# Altium schematic sheet 01_MAIN.SchDoc: =GlobalProjectName
size 594 x 420 mm; CheckedBy: A_D; Author: A_D; SheetNumber: 1; SheetTotal: 3; PageSetup: Record=PageOptions|CenterHorizontal=True|CenterVertical=True|PrintScale=0.70|XCorrection=1.00|YCorrection=1.00|PrintKind=2|BorderSize=5000000|LeftOffset=9000|BottomOffset=10100|Orientation=2|PaperLength=11176|PaperWidth=8636|Scale=100|PaperSource=259|PrintQuality=-3|MediaType=1|DitherType=10|PrintScaleMode=1|PaperKind=A3|PaperIndex=8
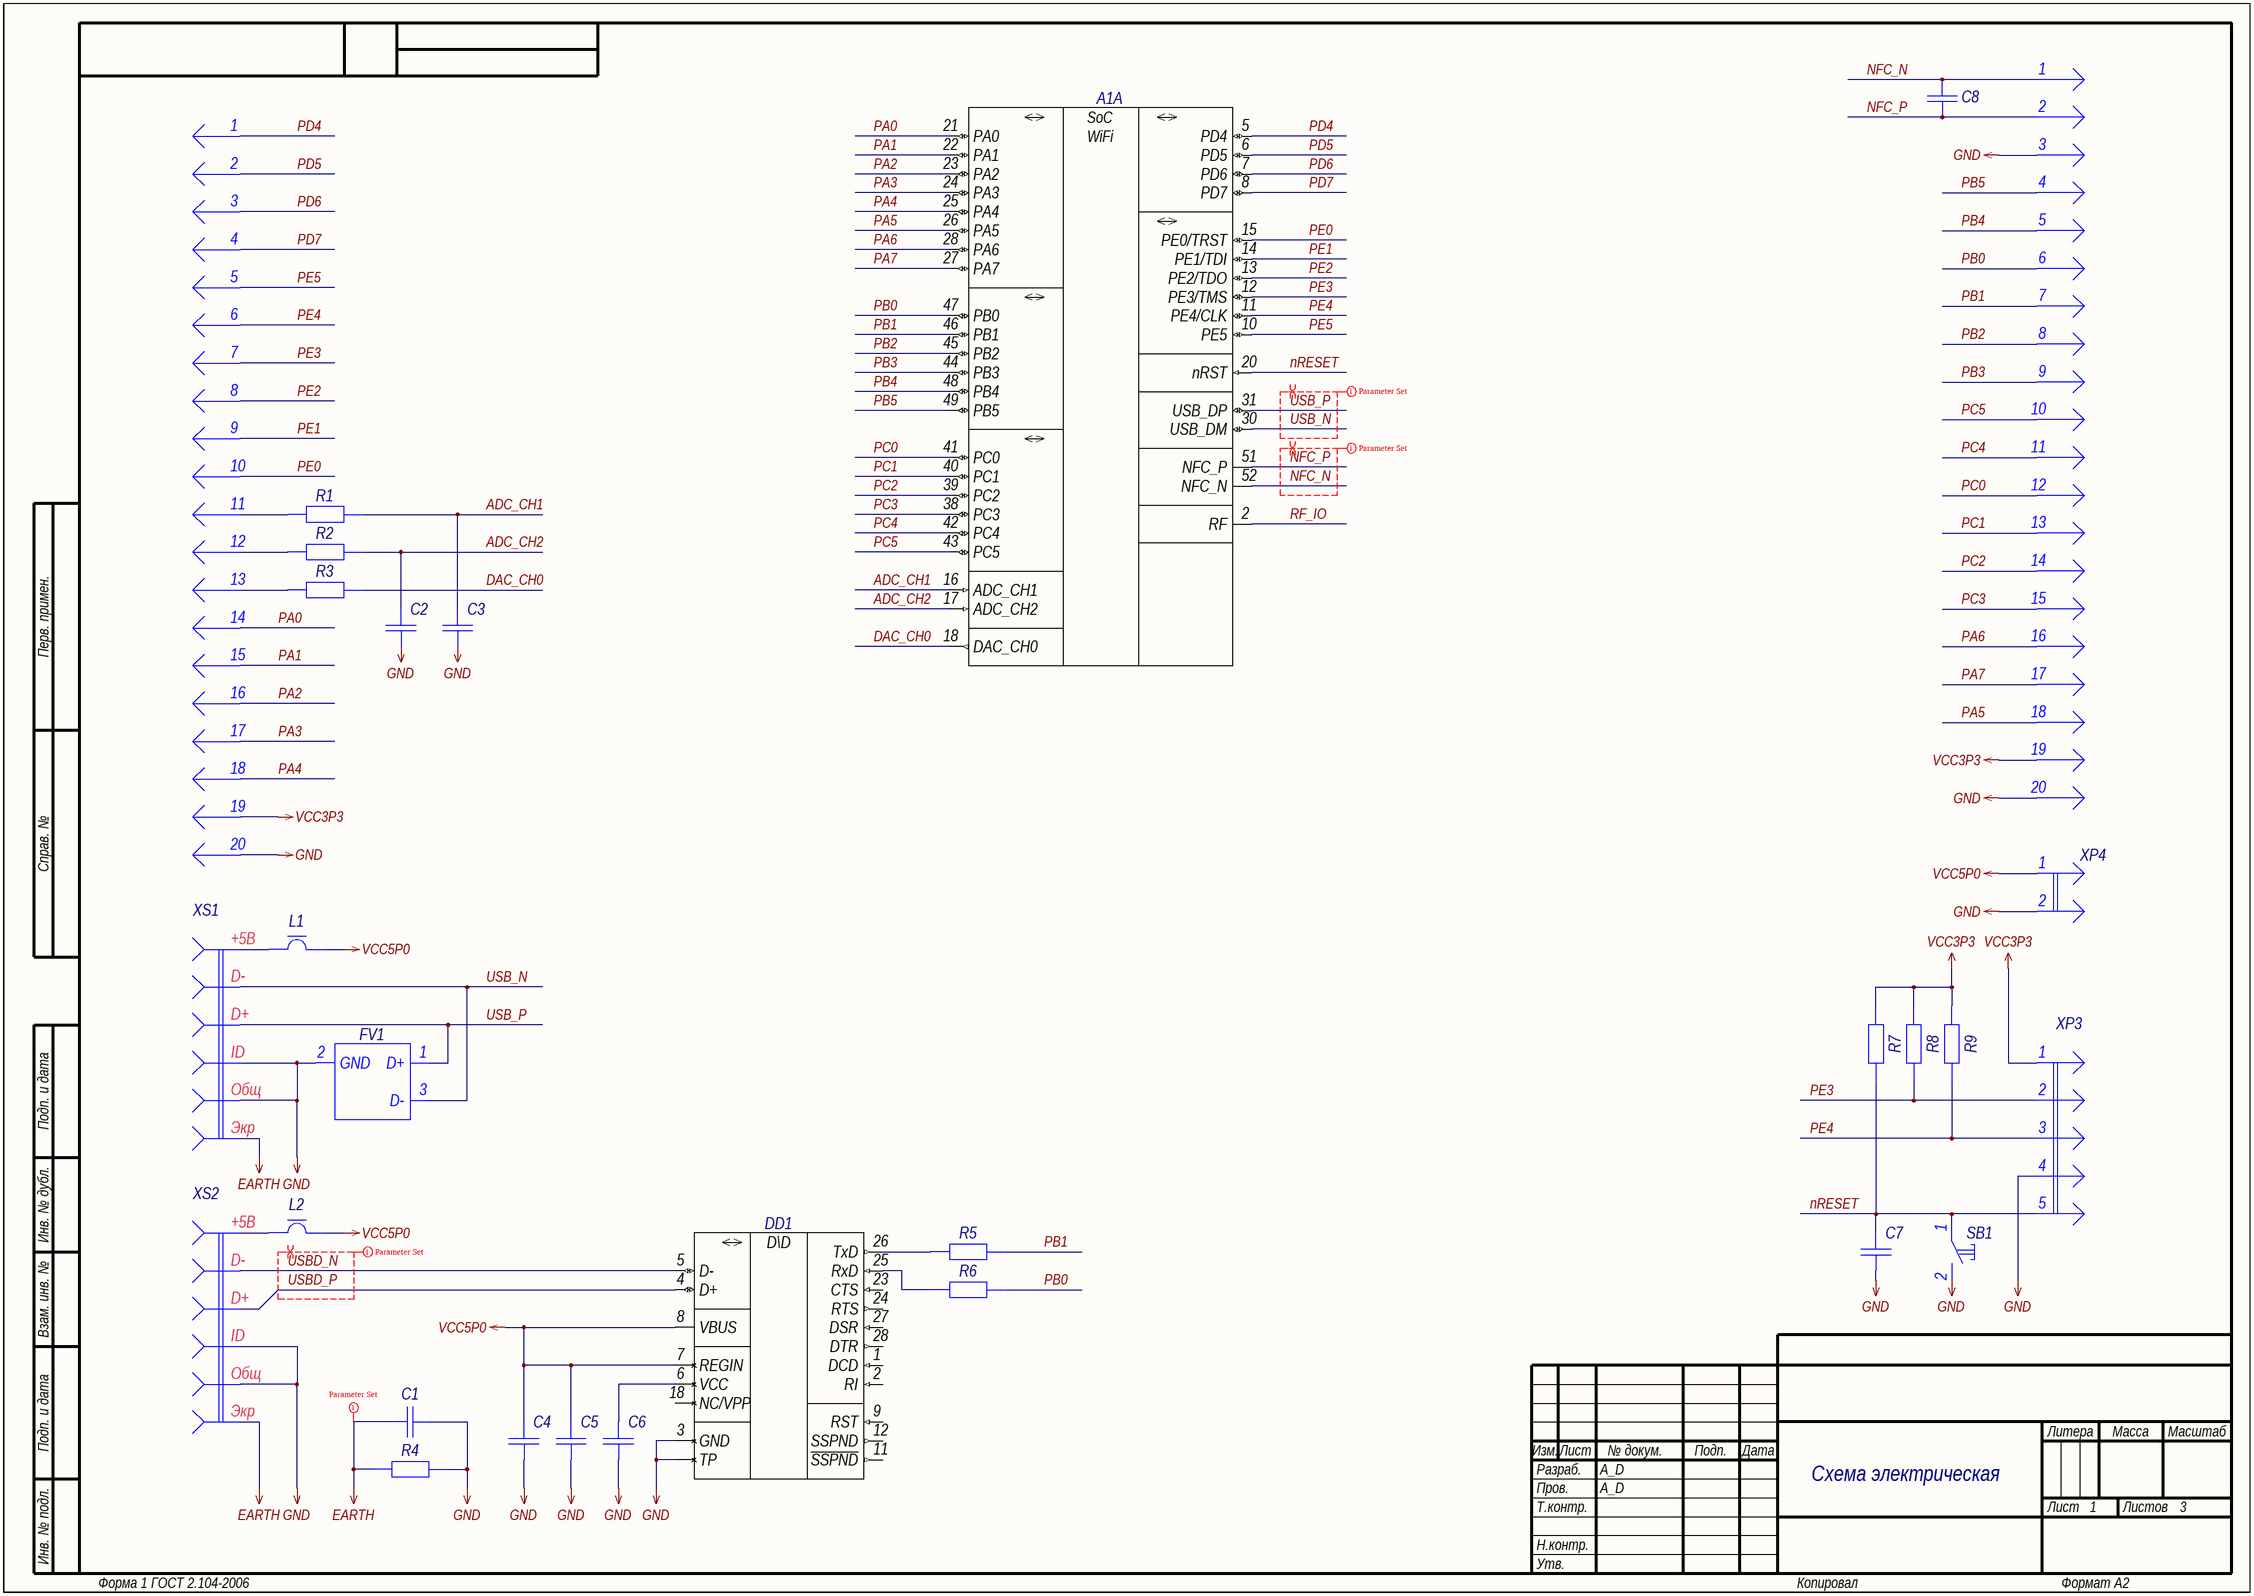
[diagram p0: 01_MAIN.SchDoc]

## Parts
A1  AMB-02  [AMB-02]  (value not drawn)  (part A of 2)
C1  Capacitor  [C0603_L]  (value not drawn)
C2  Capacitor  [C0603_L]  (value not drawn)
C3  Capacitor  [C0603_L]  (value not drawn)
C4  Capacitor  [C0603_L]  (value not drawn)
C5  Capacitor  [C0603_L]  (value not drawn)
C6  Capacitor  [C0603_L]  (value not drawn)
C7  Capacitor  [C0603_L]  (value not drawn)
C8  Capacitor  [C0603_L]  (value not drawn)
DD1  CP2102_9  [QFN-28_050P500X500X100_N]  (value not drawn)
FV1  TPD2EUSB30DRT  [SOT-3_070P100X080X050_N]  (value not drawn)
L1  FerriteBead  [L0805_L]  (value not drawn)
L2  FerriteBead  [L0805_L]  (value not drawn)
R1  Resistor  [R0603_L]  (value not drawn)
R2  Resistor  [R0603_L]  (value not drawn)
R3  Resistor  [R0603_L]  (value not drawn)
R4  Resistor  [R0603_L]  (value not drawn)
R5  Resistor  [R0603_L]  (value not drawn)
R6  Resistor  [R0603_L]  (value not drawn)
R7  Resistor  [R0603_L]  (value not drawn)
R8  Resistor  [R0603_L]  (value not drawn)
R9  Resistor  [R0603_L]  (value not drawn)
SB1  RESET  [IT-1185AP]  (value not drawn)
XP1  Text  [PLS-20]  (value not drawn)  (parts A,B,C,D,E,F,G,H,I,J,K,L,M,N,O,P,Q,R,S,T of 20)
XP2  Text  [PLS-20]  (value not drawn)  (parts A,B,C,D,E,F,G,H,I,J,K,L,M,N,O,P,Q,R,S,T of 20)
XP3  Text  [PLS-5]  (value not drawn)
XP4  Text  [PLS-2]  (value not drawn)
XS1  Text  [1981568-1]  (value not drawn)
XS2  Text  [1981568-1]  (value not drawn)

## Nets
EARTH: C1.2 R4.1 XS1.6 XS2.6
GND: C1.1 C2.1 C3.1 C4.1 C5.1 C6.1 C7.1 DD1.3(GND) DD1.TP FV1.2(GND) R4.2 SB1.2 XP1.20 XP2.3 XP2.20 XP3.4 XP4.2 XS1.4 XS1.5 XS2.4 XS2.5
VCC3P3: R7.2 R8.2 R9.2 XP1.19 XP2.19 XP3.1
VCC5P0: C4.2 C5.2 DD1.7(REGIN) DD1.8(VBUS) L1.2 L2.2 XP4.1
ADC_CH1: A1.16(ADC_CH1) C3.2 R1.2
ADC_CH2: A1.17(ADC_CH2) C2.2 R2.2
DAC_CH0: A1.18(DAC_CH0) R3.2
NFC_N: A1.52(NFC_N) C8.2 XP2.1
NFC_P: A1.51(NFC_P) C8.1 XP2.2
nRESET: A1.20(nRST) C7.2 R7.1 SB1.1 XP3.5
PA0: A1.21(PA0) XP1.14
PA1: A1.22(PA1) XP1.15
PA2: A1.23(PA2) XP1.16
PA3: A1.24(PA3) XP1.17
PA4: A1.25(PA4) XP1.18
PA5: A1.26(PA5) XP2.18
PA6: A1.28(PA6) XP2.16
PA7: A1.27(PA7) XP2.17
PB0: A1.47(PB0) R6.2 XP2.6
PB1: A1.46(PB1) R5.2 XP2.7
PB2: A1.45(PB2) XP2.8
PB3: A1.44(PB3) XP2.9
PB4: A1.48(PB4) XP2.5
PB5: A1.49(PB5) XP2.4
PC0: A1.41(PC0) XP2.12
PC1: A1.40(PC1) XP2.13
PC2: A1.39(PC2) XP2.14
PC3: A1.38(PC3) XP2.15
PC4: A1.42(PC4) XP2.11
PC5: A1.43(PC5) XP2.10
PD4: A1.5(PD4) XP1.1
PD5: A1.6(PD5) XP1.2
PD6: A1.7(PD6) XP1.3
PD7: A1.8(PD7) XP1.4
PE0: A1.15(PE0/TRST) XP1.10
PE1: A1.14(PE1/TDI) XP1.9
PE2: A1.13(PE2/TDO) XP1.8
PE3: A1.12(PE3/TMS) R8.1 XP1.7 XP3.2
PE4: A1.11(PE4/CLK) R9.1 XP1.6 XP3.3
PE5: A1.10(PE5) XP1.5
RF_IO: A1.2(RF)
USB_N: A1.30(USB_DM) FV1.3(D-) XS1.2
USB_P: A1.31(USB_DP) FV1.1(D+) XS1.3
USBD_N: DD1.5(D-) XS2.2
USBD_P: DD1.4(D+) XS2.3
NetC6_2: C6.2 DD1.6(VCC)
NetDD1_25: DD1.25(RxD) R6.1
NetDD1_26: DD1.26(TxD) R5.1
NetL1_1: L1.1 XS1.1
NetL2_1: L2.1 XS2.1
NetR1_1: R1.1 XP1.11
NetR2_1: R2.1 XP1.12
NetR3_1: R3.1 XP1.13

Not connected (* = marked no-connect by the designer): DD1 1(DCD) 2(RI) 9(RST) 11(~{SSPND}) 12(SSPND) 18(NC/VPP) 23(CTS) 24(RTS) 27(DSR) 28(DTR)

## Layout directives
differential pair: NFC_N, NFC_P, USB_N, USB_P, USBD_N, USBD_P
net class USBD; rule Matched Net Lengths [Tolerance = 1mm]: USBD_N, USBD_P
net class USB; rule Matched Net Lengths [Tolerance = 1mm]: USB_N, USB_P
net class NFC; rule Matched Net Lengths [Tolerance = 1mm]: NFC_N, NFC_P
rule Polygon Connect Style [Style - Direct Connect]: EARTH

## Notes on the sheet
- Схема электрическая
  принципиальная
- Перв. примен.
- Справ. №
- Подп. и дата
- Инв. № дубл.
- Взам. инв. №
- Разраб.
- Изм.
- Лист
- № докум.
- Подп.
- Дата
- Литера
- Масса
- Масштаб
- Пров.
- Т.контр.
- Листов
- Инв. № подл.
- Н.контр.
- Утв.
- Форма 1 ГОСТ 2.104-2006
- Копировал
- Формат А2
- (in symbol 1981568-1) +5В; D-; D+; ID; Общ; Экр
- (in symbol CP2102-GM) D\D
- (in symbol MJIOT-AMB-02, part A) SoC; WiFi

## Library data of the parts
A1 = MJIOT-AMB-02: Manufacturer: MJIOT; ID: 3; Supply Operation: +3.0…3.6V; Supply Current: 450mA; ROM/RAM: 1MB/2MB+512KB; Wireless Compatibility: 802.11 b/g/n; Supported Interfaces: JTAG, SWD, SPI, I2C, I2S, UART, PWM, PCM, SDIO, NFC, ADC, DAC, USB HS, MII/RMII; I/O Lines: 30; Operation Frequency: 166MHz; Application Category: 1; Working Temperature Min: -20°С; Working Temperature Max: +85°С; Published: 12.12.2017; Publisher: Andrew Danich; Type: Модуль; Part Number: MJIOT-AMB-02; Value: MJIOT-AMB-02
C1 C5-C7 = GRM188R72A104KA35D: Manufacturer: Murata; Type: Конденсатор; ID: 232; Value: 0.1uF; Voltage: 100V; Tolerance: ±10%; Dielectric Type: X7R; Application Category: 1; Working Temperature Min: -55°С; Working Temperature Max: +125°С; Published: 18.05.2010; Publisher: Andrew Danich; Part Number: GRM188R72A104KA35D; Footprint: 0603
  C1: ClassName: DirectConnect
C2 C3 = GCM1885C2A101JA16D: Manufacturer: Murata; Type: Конденсатор; ID: 155; Value: 100pF; Voltage: 100V; Tolerance: ±5%; Dielectric Type: NP0; Application Category: 1; Working Temperature Min: -55°С; Working Temperature Max: +125°С; Published: 18.05.2010; Publisher: Andrew Danich; Part Number: GCM1885C2A101JA16D; Footprint: 0603
C4 = GCM188R71E105KA64D: Manufacturer: Murata; Type: Конденсатор; ID: 134; Value: 1uF; Voltage: 25V; Tolerance: ±10%; Dielectric Type: X7R; Application Category: 1; Working Temperature Min: -55°С; Working Temperature Max: +85°С; Published: 18.05.2010; Publisher: Andrew Danich; Part Number: GCM188R71E105KA64D; Footprint: 0603
C8 = GRM1885C2A8R2DA01D: Manufacturer: Murata; Type: Конденсатор; ID: 215; Value: 8.2pF; Voltage: 100V; Tolerance: ±0.5pF; Dielectric Type: NP0; Application Category: 1; Working Temperature Min: -55°С; Working Temperature Max: +125°С; Published: 18.05.2010; Publisher: Andrew Danich; Part Number: GRM1885C2A8R2DA01D; Footprint: 0603
DD1 = CP2102-GM: Single Chip USB to UART Bridge; Manufacturer: Silicon Labs; ID: 4; Supply Operation: +3.3V; Supply Current: 13.7mA; USB Type Support: USB 2.0; USB Speed Support: 12 Mb/s; OTG Support: No; Channels: 1; Working Temperature Min: -40°C; Working Temperature Max: +85°C; Published: 03.08.2015; Publisher: Andrew Danich; Type: Микросхема; Part Number: CP2102-GM; Value: CP2102-GM; Input Interface: UART; Application Category: 1; Functional Analog: -
FV1 = TPD2EUSB30DRT: Manufacturer: Texas Instruments; ID: 5; Breakdown Voltage: 7V; Reverse Stand Off Voltage: 5.5V; Forward Voltage: 0.95V; Peak Forward Current: 5A; Junction Capacitance: 0.8pF; Pulse Power Dissipation: 45W; Directional: Bidirectional; Application Category: 1; Working Temperature Min: -40°С; Working Temperature Max: +85°С; Published: 27.12.2015; Publisher: Andrew Danich; Type: Супрессор; Part Number: TPD2EUSB30DRT; Value: TPD2EUSB30DRT; Functional Analog: -
L1 L2 = BLM21PG331SN1: Manufacturer: Murata; Type: Дроссель; ID: 2; Rated Current: 1.5A; Impedance at 100Mhz: 330ohm; DC Resistance: 0.07ohm; Inductor Type: EMIFIL; Application Category: 1; Working Temperature Min: -55°С; Working Temperature Max: +125°С; Published: 14.11.2014; Publisher: Andrew Danich; Part Number: BLM21PG331SN1; Value: BLM21PG331SN1; Footprint: 0805; ClassName: DirectConnect
R1 R2 = RC0603JR-07100R: Manufacturer: Yageo; ID: 10; Value: 100; Limit Voltage: 50V; Tolerance: ±5%; Temperature Coefficient: 100ppm; Total Power Dissipation: 0.1W; Series Type: Thick-Film; Application Category: 1; Working Temperature Min: -55°С; Working Temperature Max: +155°С; Functional Analog: CR0603-JW-101E; Published: 24.03.2010; Publisher: Andrew Danich; Type: Резистор; Part Number: RC0603JR-07100R; Footprint: 0603
R3 = RC0603JR-070R: Manufacturer: Yageo; ID: 5; Value: 0; Limit Voltage: 50V; Tolerance: ±5%; Temperature Coefficient: 100ppm; Total Power Dissipation: 0.1W; Series Type: Thick-Film; Application Category: 1; Working Temperature Min: -55°С; Working Temperature Max: +155°С; Functional Analog: RC0603FR-070RL, CR0603-J/-000E; Published: 24.03.2010; Publisher: Andrew Danich; Type: Резистор; Part Number: RC0603JR-070R; Footprint: 0603
R4 = RC0603JR-07100KL: Manufacturer: Yageo; ID: 11; Value: 100k; Limit Voltage: 50V; Tolerance: ±5%; Temperature Coefficient: 100ppm; Total Power Dissipation: 0.1W; Series Type: Thick-Film; Application Category: 1; Working Temperature Min: -55°С; Working Temperature Max: +155°С; Functional Analog: CR0603-JW-104E; Published: 24.03.2010; Publisher: Andrew Danich; Type: Резистор; Part Number: RC0603JR-07100KL; Footprint: 0603; ClassName: DirectConnect
R5 R6 = RC0603JR-071KL: Manufacturer: Yageo; ID: 19; Value: 1k; Limit Voltage: 50V; Tolerance: ±5%; Temperature Coefficient: 100ppm; Total Power Dissipation: 0.1W; Series Type: Thick-Film; Application Category: 1; Working Temperature Min: -55°С; Working Temperature Max: +155°С; Functional Analog: CR0603-JW-102E; Published: 24.03.2010; Publisher: Andrew Danich; Type: Резистор; Part Number: RC0603JR-071KL; Footprint: 0603
R7-R9 = RC0603JR-0710KL: Manufacturer: Yageo; ID: 12; Value: 10k; Limit Voltage: 50V; Tolerance: ±5%; Temperature Coefficient: 100ppm; Total Power Dissipation: 0.1W; Series Type: Thick-Film; Application Category: 1; Working Temperature Min: -55°С; Working Temperature Max: +155°С; Functional Analog: CR0603-JW-103E; Published: 24.03.2010; Publisher: Andrew Danich; Type: Резистор; Part Number: RC0603JR-0710KL; Footprint: 0603
SB1 = IT-1185AP: ID: 36; Limit Current: 50mA; Resistance: 0.1ohm; Isolator Resistance: 100meg; Backlight: NO; Number of Contacts: 2; Application Category: 1; Published: 17.04.2014; Publisher: Andrew Danich; Type: Переключатель; Part Number: IT-1185AP; Value: IT-1185AP; Height: 5mm
XP1 XP2 = PLS-20: ID: 26; Value: PLS-20; Limit Voltage: 250V; Limit Current: 3A; Connector Type: Male; Resistance: 15momh; Surface Finish: Gold; Pitch: 2.54mm; Application Category: 1; Published: 24.08.2015; Publisher: Andrew Danich; Type: Вилка; Part Number: PLS-20; Pins: 20
XP3 = PLS-5: Value: PLS-5; ID: 4; Limit Voltage: 250V; Limit Current: 3A; Connector Type: Male; Resistance: 15momh; Surface Finish: Gold; Pitch: 2.54mm; Application Category: 1; Published: 07.03.2013; Publisher: Andrew Danich; Type: Вилка; Part Number: PLS-5; Pins: 5
XP4 = PLS-2: Value: PLS-2; ID: 1; Limit Voltage: 250V; Limit Current: 3A; Connector Type: Male; Resistance: 15momh; Surface Finish: Gold; Pitch: 2.54mm; Published: 07.03.2013; Publisher: Andrew Danich; Type: Вилка; Part Number: PLS-2; Pins: 2; Application Category: 1
XS1 XS2 = 1981568-1: Manufacturer: TE Connectivity; ID: 30; Limit Voltage: 24V; Limit Current: 1A; Connector Type: Female; Interface: USB 2.0; Max Data Rate: 480 mbps; Application Category: 1; Published: 11.04.2016; Publisher: Andrew Danich; Type: Розетка; Part Number: 1981568-1; Value: 1981568-1; Pins: 9; Mount Type: Surface; ClassName: DirectConnect